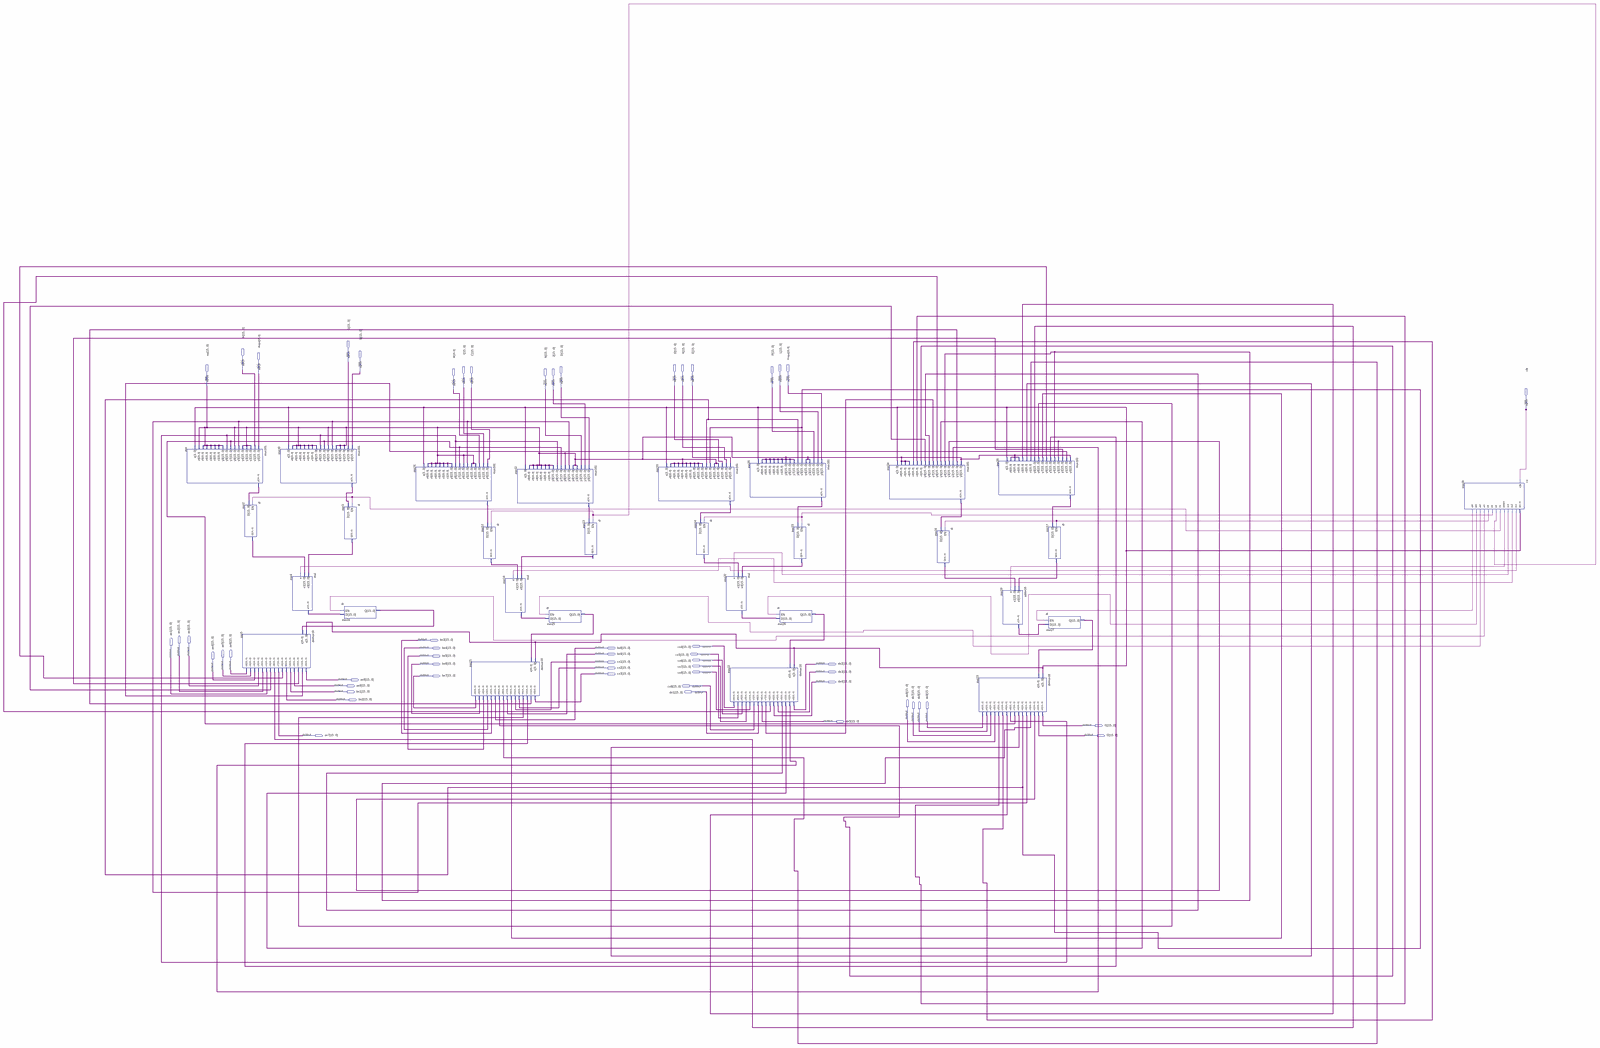
[diagram p0: schematic sheet, whole]
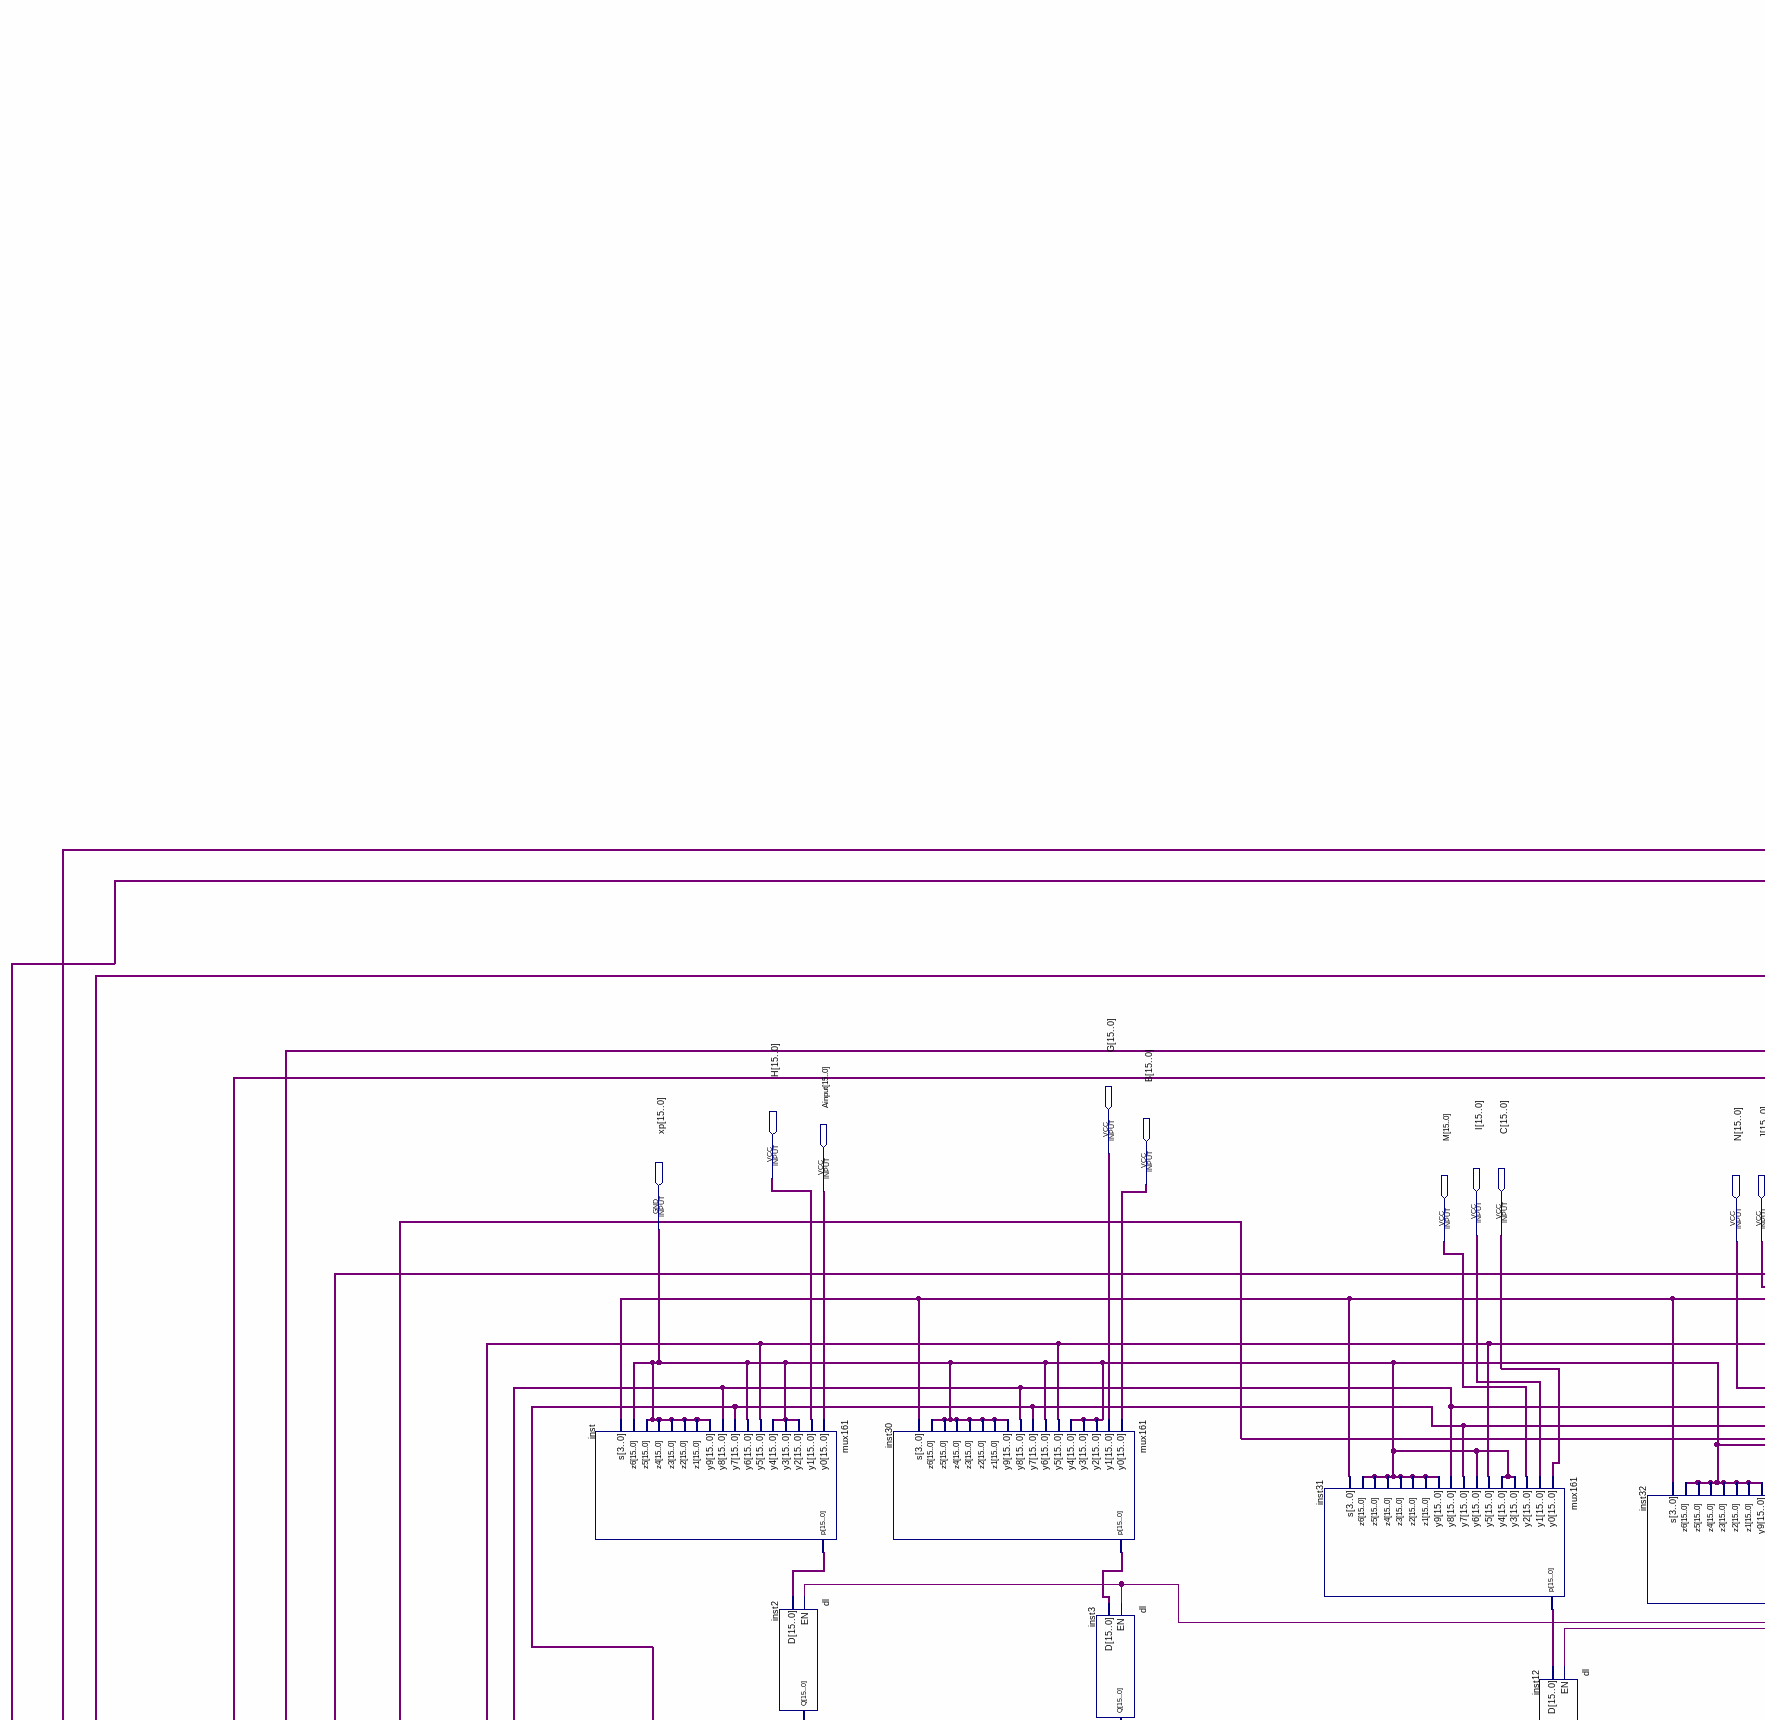
[diagram p1: schematic sheet, upper left part]
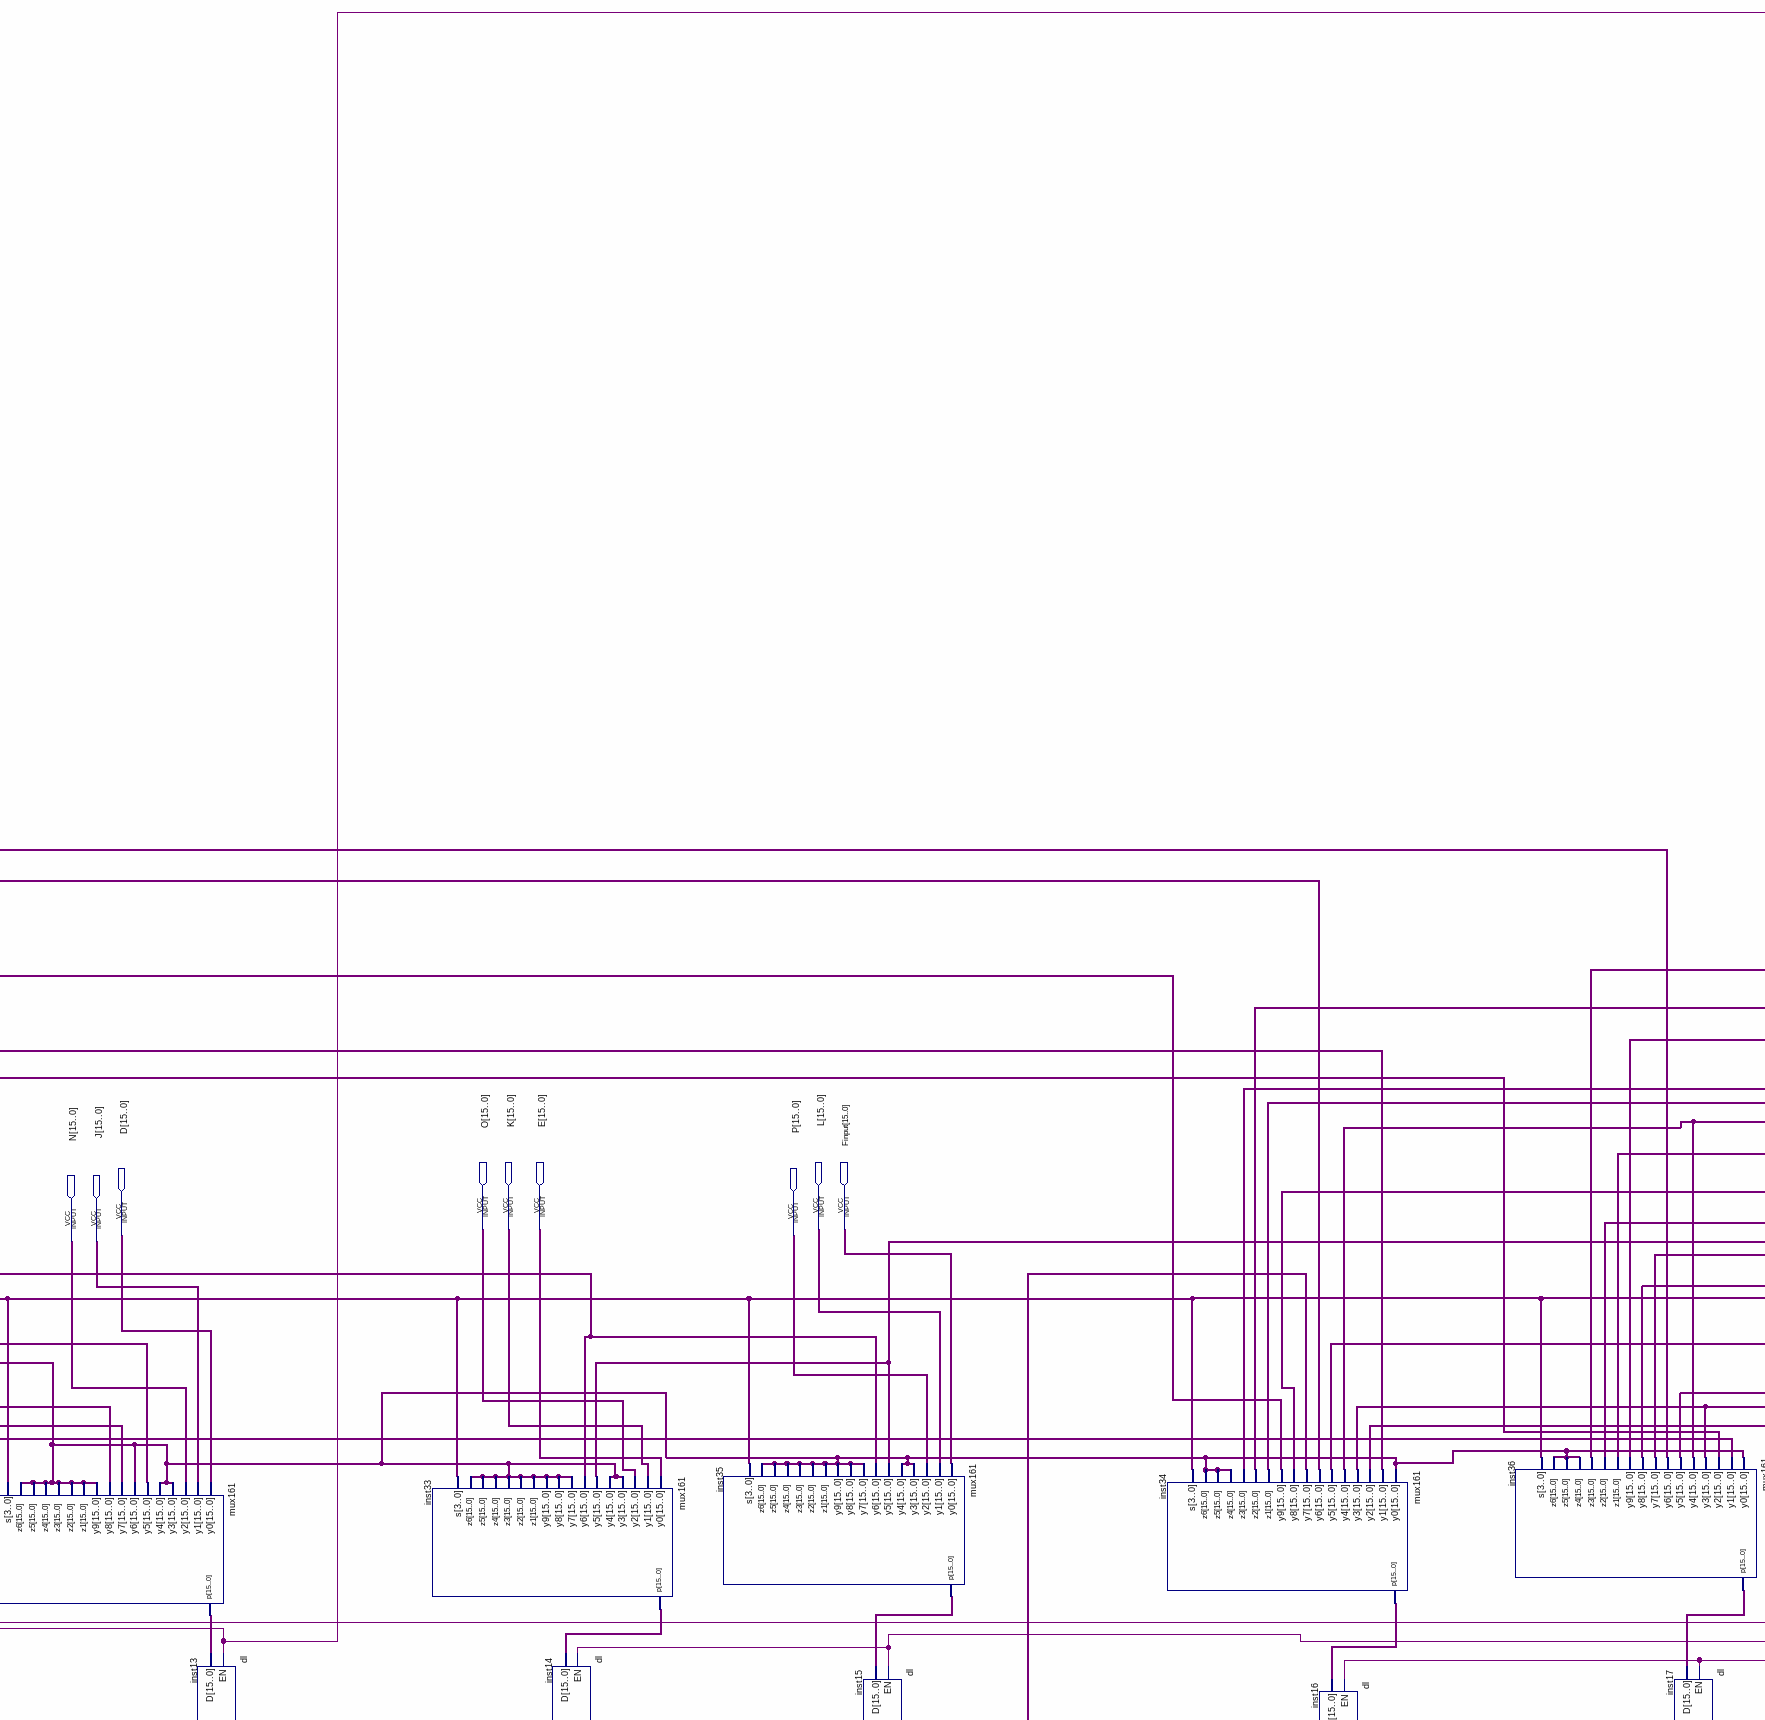
[diagram p2: schematic sheet, upper centre part]
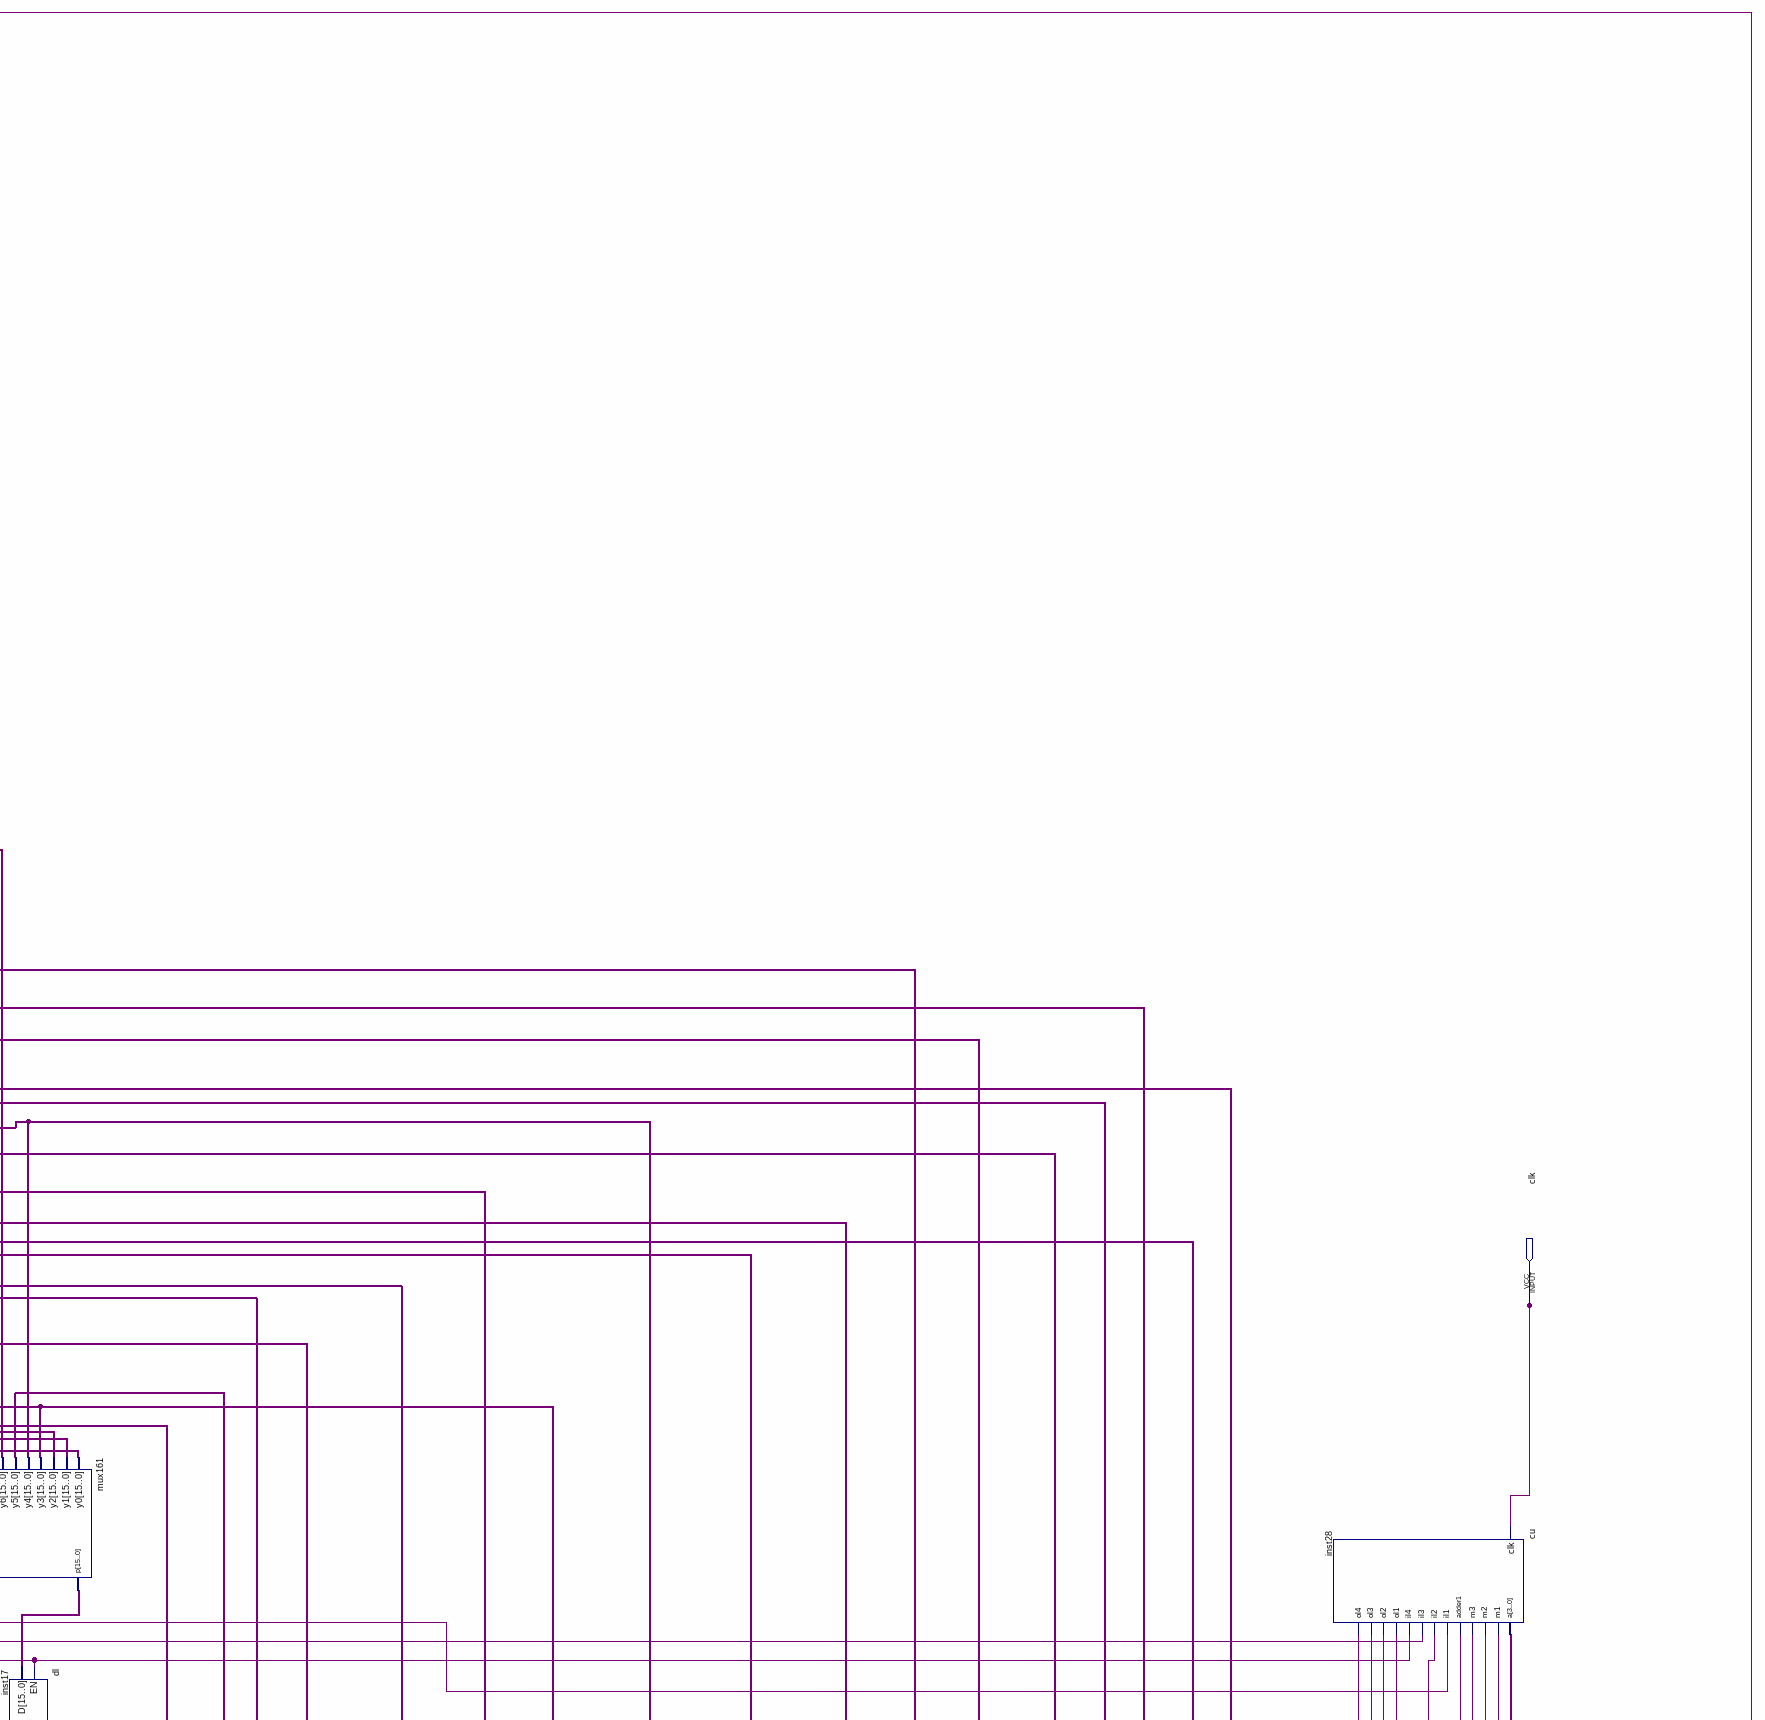
[diagram p3: schematic sheet, upper right part]
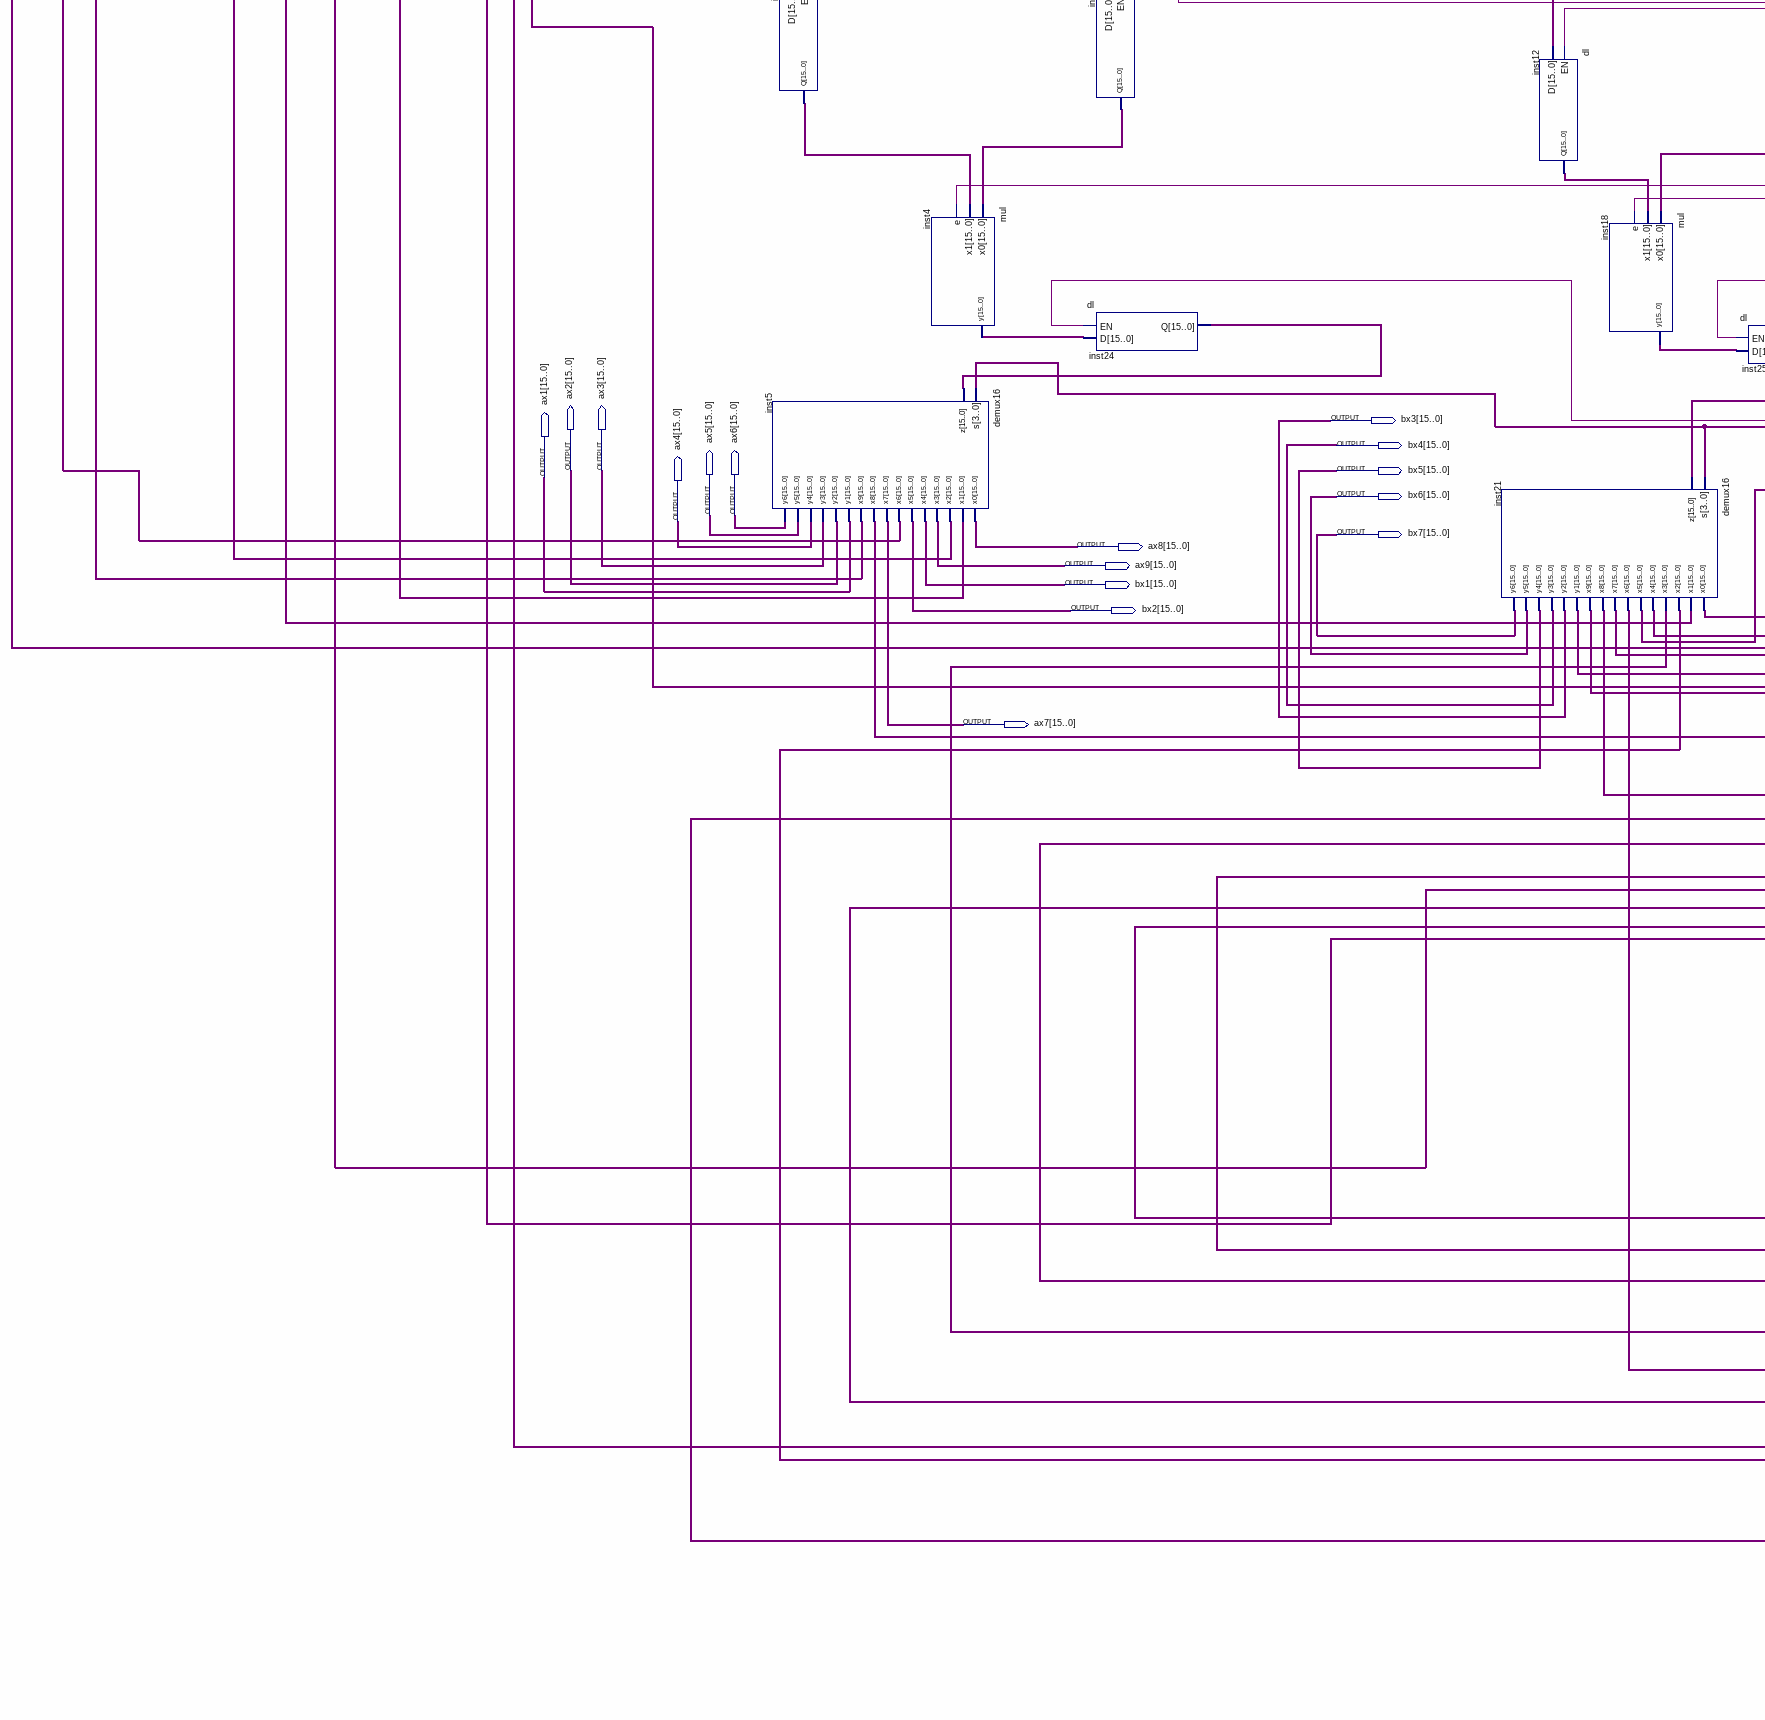
[diagram p4: schematic sheet, lower left part]
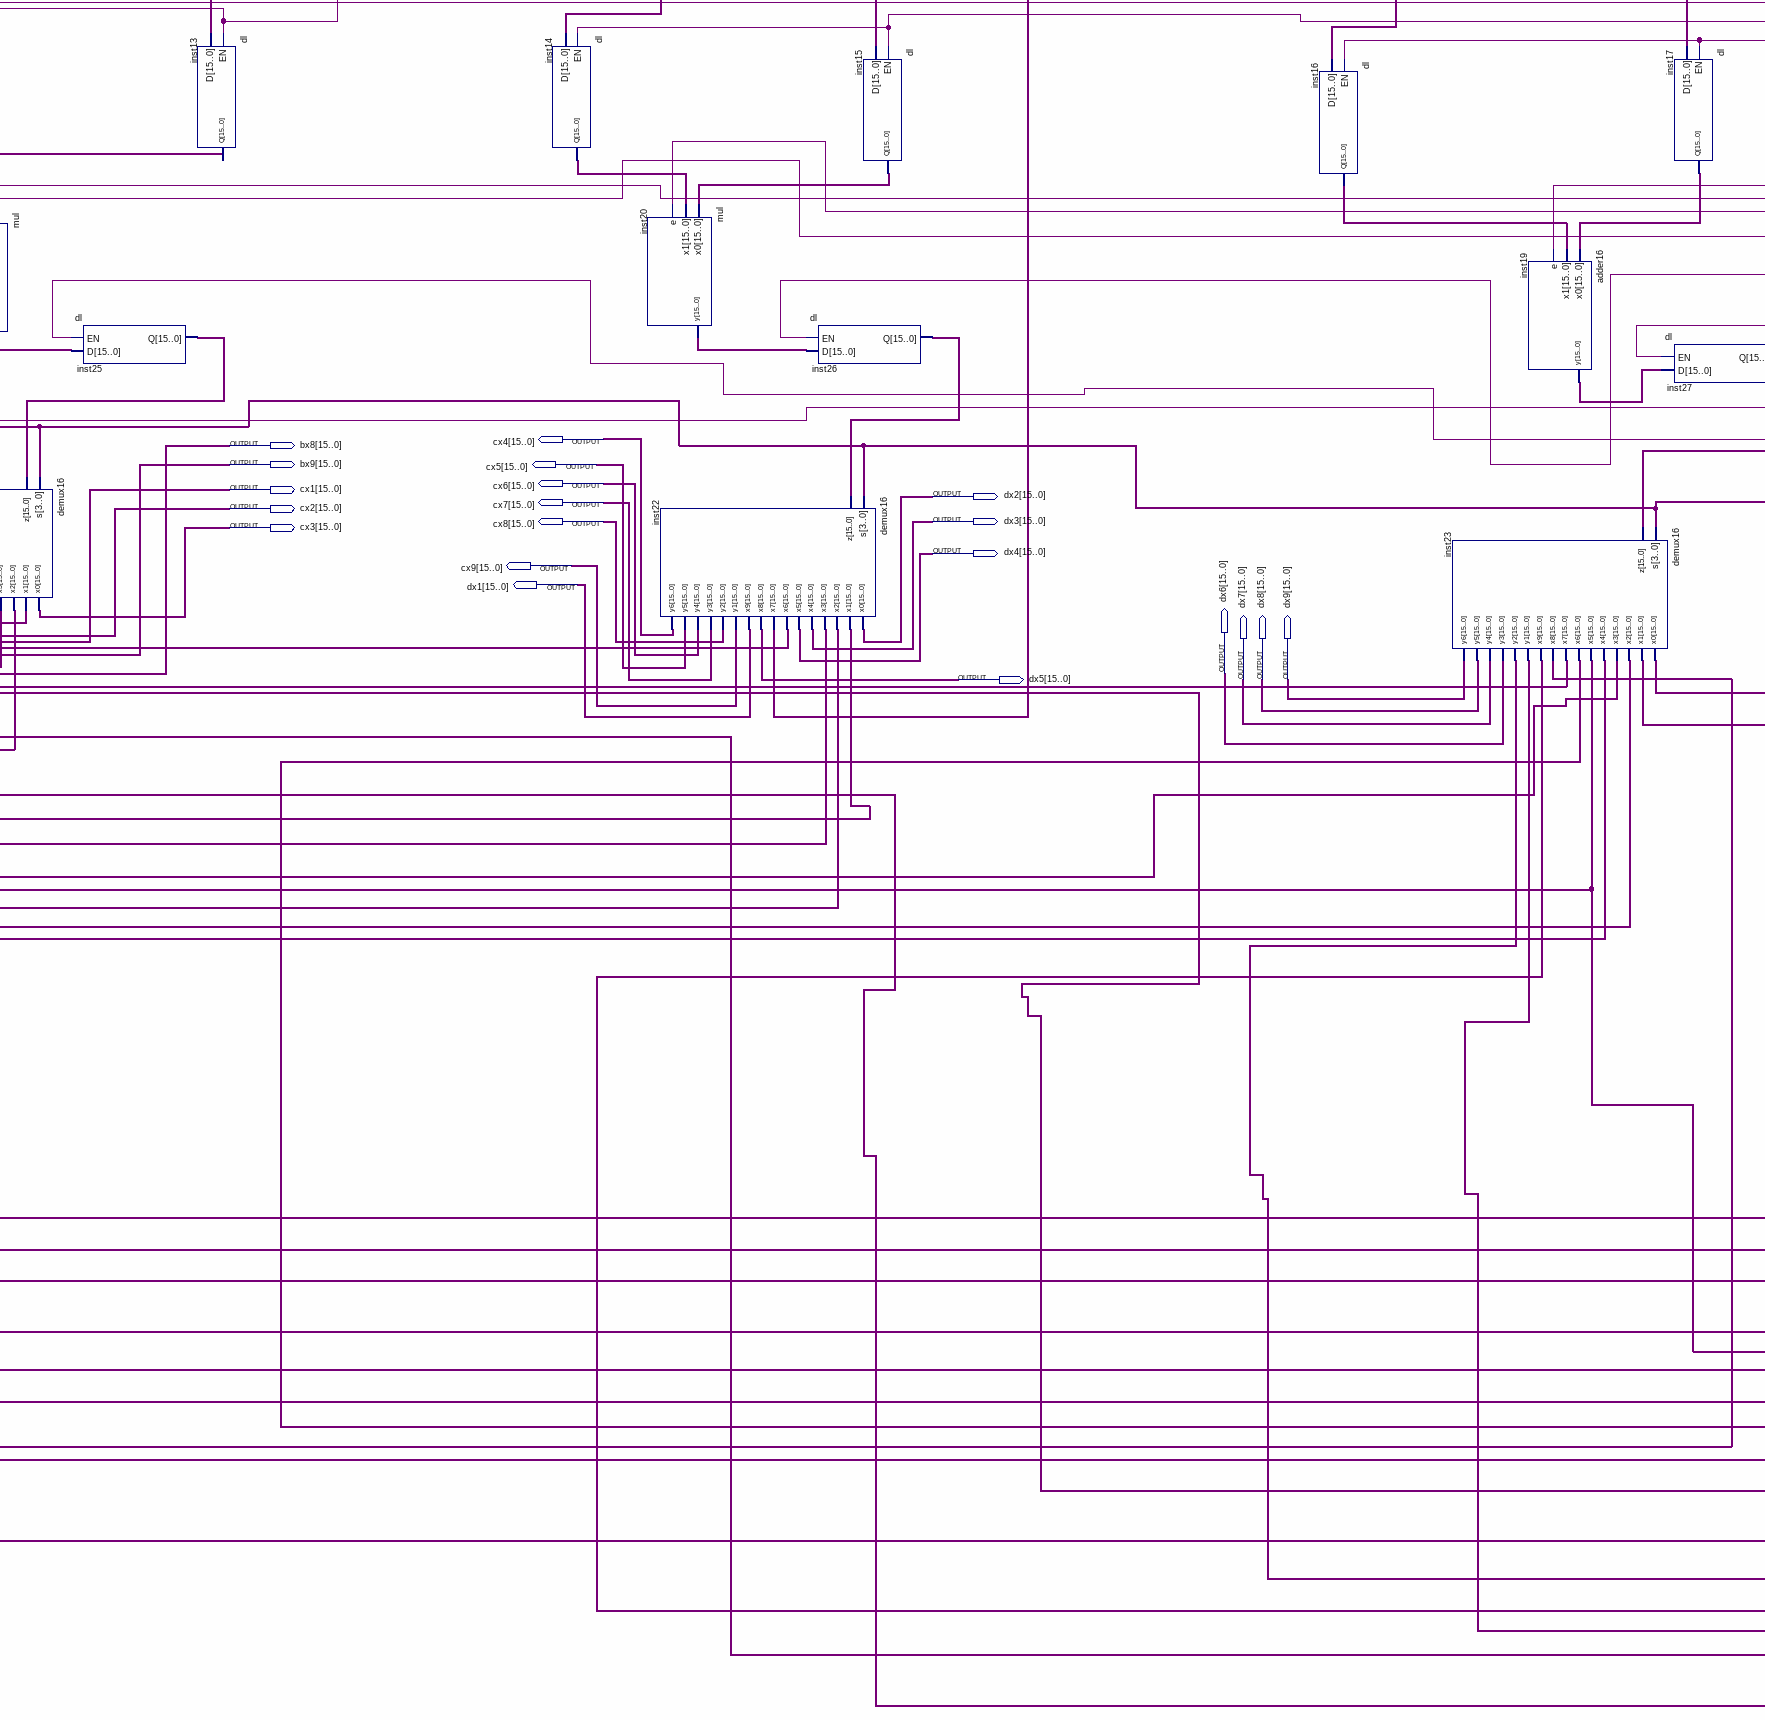
[diagram p5: schematic sheet, lower centre part]
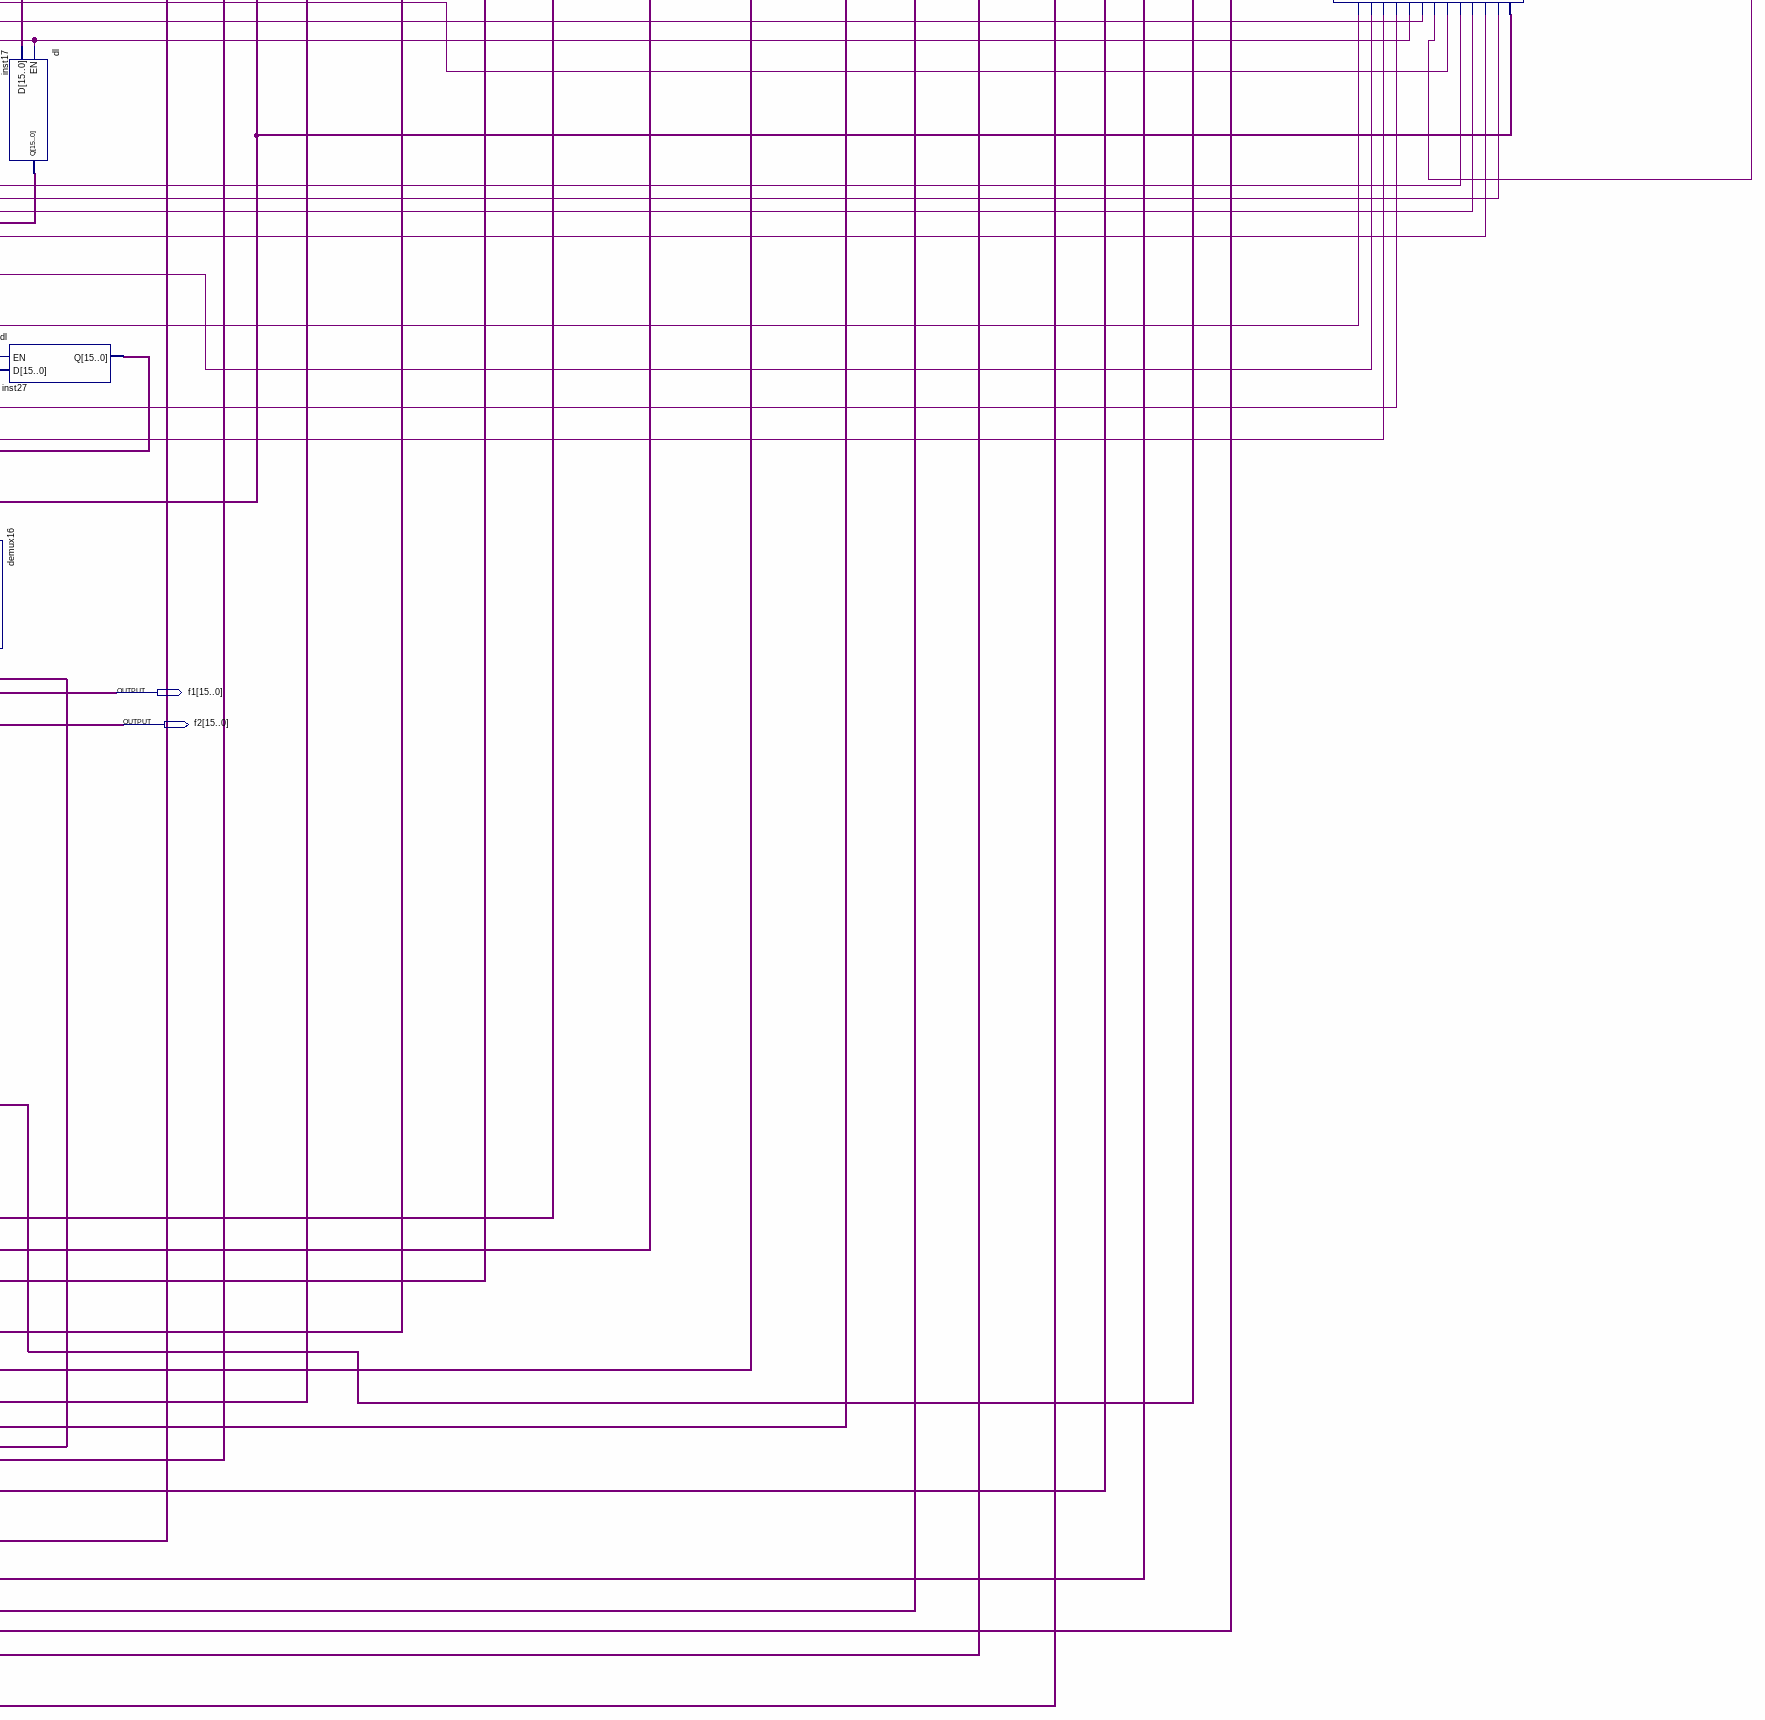
[diagram p6: schematic sheet, lower right part]
// Quartus schematic lab1.bdf as structural Verilog: 29 symbols, 56 pins
module lab1 (
  input  [15:0] G,
  input  [15:0] H,
  input  [15:0] B,
  input  [15:0] Ainput,
  input  [15:0] xp,
  input  [15:0] O,
  input  [15:0] K,
  input  [15:0] E,
  input  [15:0] L,
  input  [15:0] Finput,
  input  [15:0] I,
  input  [15:0] C,
  input  [15:0] D,
  input  [15:0] P,
  input  [15:0] M,
  input  [15:0] N,
  input  [15:0] J,
  input  clk,
  output [15:0] bx3,
  output [15:0] cx4,
  output [15:0] bx4,
  output [15:0] bx8,
  output [15:0] bx9,
  output [15:0] cx5,
  output [15:0] ax2,
  output [15:0] ax3,
  output [15:0] bx5,
  output [15:0] ax1,
  output [15:0] cx6,
  output [15:0] cx1,
  output [15:0] bx6,
  output [15:0] dx2,
  output [15:0] cx7,
  output [15:0] cx2,
  output [15:0] ax5,
  output [15:0] ax6,
  output [15:0] ax4,
  output [15:0] cx8,
  output [15:0] dx3,
  output [15:0] cx3,
  output [15:0] bx7,
  output [15:0] ax8,
  output [15:0] dx4,
  output [15:0] ax9,
  output [15:0] cx9,
  output [15:0] bx1,
  output [15:0] dx1,
  output [15:0] bx2,
  output [15:0] dx6,
  output [15:0] dx5,
  output [15:0] dx7,
  output [15:0] dx8,
  output [15:0] dx9,
  output [15:0] f1,
  output [15:0] ax7,
  output [15:0] f2
);

  wire inst28_adder1, inst28_il1, inst28_il2, inst28_il3, inst28_il4, inst28_m1, inst28_m2, inst28_m3,
       inst28_ol1, inst28_ol2, inst28_ol3, inst28_ol4;
  wire [3:0] inst28_a;
  wire [15:0] inst2_q, inst3_q, inst4_y, inst5_x1, inst5_x2, inst5_x6, inst5_x8, inst5_x9, inst12_q,
       inst13_q, inst14_q, inst15_q, inst16_q, inst17_q, inst18_y, inst19_y, inst20_y, inst21_x1, inst21_x2,
       inst21_x3, inst21_x6, inst21_x8, inst21_x9, inst22_x1, inst22_x2, inst22_x3, inst22_x6, inst22_x7,
       inst23_x2, inst23_x3, inst23_x4, inst23_x5, inst23_x6, inst23_x7, inst23_x8, inst23_x9, inst23_y1,
       inst23_y2, inst24_q, inst25_q, inst26_q, inst27_q, inst30_p, inst31_p, inst32_p, inst33_p, inst34_p,
       inst35_p, inst36_p, inst_p;

  mux161 inst (
    .y0(Ainput), .y1(H), .y2(xp), .y3(xp), .y4(xp), .y5(inst23_x4), .y6(xp), .y7(inst23_x7), .y8(inst23_x8),
    .y9(xp), .z1(xp), .z2(xp), .z3(xp), .z4(xp), .z5(xp), .z6(xp), .s(inst28_a), .p(inst_p));
  dl inst2 (.EN(inst28_il1), .D(inst_p), .Q(inst2_q));
  demux16 inst5 (
    .s(inst28_a), .z(inst24_q), .x0(ax8), .x1(inst5_x1), .x2(inst5_x2), .x3(ax9), .x4(bx1), .x5(bx2),
    .x6(inst5_x6), .x7(ax7), .x8(inst5_x8), .x9(inst5_x9), .y1(ax1), .y2(ax2), .y3(ax3), .y4(ax4), .y5(ax5),
    .y6(ax6));
  mux161 inst30 (
    .y0(B), .y1(G), .y2(xp), .y3(xp), .y4(xp), .y5(inst23_x4), .y6(xp), .y7(inst23_x7), .y8(inst23_x8),
    .y9(xp), .z1(xp), .z2(xp), .z3(xp), .z4(xp), .z5(xp), .z6(xp), .s(inst28_a), .p(inst30_p));
  mul inst4 (.x0(inst3_q), .x1(inst2_q), .e(inst28_m1), .y(inst4_y));
  dl inst3 (.EN(inst28_il1), .D(inst30_p), .Q(inst3_q));
  dl inst24 (.EN(inst28_ol1), .D(inst4_y), .Q(inst24_q));
  mux161 inst31 (
    .y0(C), .y1(I), .y2(M), .y3(xp), .y4(xp), .y5(inst23_x4), .y6(xp), .y7(inst23_x7), .y8(inst23_x8),
    .y9(xp), .z1(xp), .z2(xp), .z3(xp), .z4(xp), .z5(xp), .z6(xp), .s(inst28_a), .p(inst31_p));
  demux16 inst21 (
    .s(inst28_a), .z(inst25_q), .x0(cx3), .x1(inst21_x1), .x2(inst21_x2), .x3(inst21_x3), .x4(cx2), .x5(cx1),
    .x6(inst21_x6), .x7(bx9), .x8(inst21_x8), .x9(inst21_x9), .y1(bx8), .y2(bx3), .y3(bx4), .y4(bx5),
    .y5(bx6), .y6(bx7));
  dl inst12 (.EN(inst28_il2), .D(inst31_p), .Q(inst12_q));
  mux161 inst32 (
    .y0(D), .y1(J), .y2(N), .y3(xp), .y4(xp), .y5(inst23_x4), .y6(xp), .y7(inst23_x7), .y8(inst23_x8),
    .y9(xp), .z1(xp), .z2(xp), .z3(xp), .z4(xp), .z5(xp), .z6(xp), .s(inst28_a), .p(inst32_p));
  mul inst18 (.x0(inst13_q), .x1(inst12_q), .e(inst28_m2), .y(inst18_y));
  dl inst25 (.EN(inst28_ol2), .D(inst18_y), .Q(inst25_q));
  dl inst13 (.EN(inst28_il2), .D(inst32_p), .Q(inst13_q));
  mux161 inst33 (
    .y0(E), .y1(K), .y2(O), .y3(xp), .y4(xp), .y5(inst23_x5), .y6(inst23_x5), .y7(xp), .y8(xp), .y9(xp),
    .z1(xp), .z2(xp), .z3(xp), .z4(xp), .z5(xp), .z6(xp), .s(inst28_a), .p(inst33_p));
  dl inst14 (.EN(inst28_il3), .D(inst33_p), .Q(inst14_q));
  mul inst20 (.x0(inst15_q), .x1(inst14_q), .e(inst28_m3), .y(inst20_y));
  demux16 inst22 (
    .s(inst28_a), .z(inst26_q), .x0(dx2), .x1(inst22_x1), .x2(inst22_x2), .x3(inst22_x3), .x4(dx3), .x5(dx4),
    .x6(inst22_x6), .x7(inst22_x7), .x8(dx5), .x9(dx1), .y1(cx9), .y2(cx8), .y3(cx7), .y4(cx6), .y5(cx5),
    .y6(cx4));
  mux161 inst35 (
    .y0(Finput), .y1(L), .y2(P), .y3(xp), .y4(xp), .y5(inst23_x5), .y6(inst23_x5), .y7(xp), .y8(xp), .y9(xp),
    .z1(xp), .z2(xp), .z3(xp), .z4(xp), .z5(xp), .z6(xp), .s(inst28_a), .p(inst35_p));
  dl inst26 (.EN(inst28_ol3), .D(inst20_y), .Q(inst26_q));
  dl inst15 (.EN(inst28_il3), .D(inst35_p), .Q(inst15_q));
  mux161 inst34 (
    .y0(xp), .y1(inst21_x1), .y2(inst22_x1), .y3(inst23_x2), .y4(inst23_x3), .y5(inst22_x2), .y6(inst22_x6),
    .y7(inst22_x7), .y8(inst22_x3), .y9(inst5_x9), .z1(inst21_x9), .z2(inst23_y2), .z3(inst23_y1), .z4(xp),
    .z5(xp), .z6(xp), .s(inst28_a), .p(inst34_p));
  dl inst16 (.EN(inst28_il4), .D(inst34_p), .Q(inst16_q));
  demux16 inst23 (
    .s(inst28_a), .z(inst27_q), .x0(f1), .x1(f2), .x2(inst23_x2), .x3(inst23_x3), .x4(inst23_x4),
    .x5(inst23_x5), .x6(inst23_x6), .x7(inst23_x7), .x8(inst23_x8), .x9(inst23_x9), .y1(inst23_y1),
    .y2(inst23_y2), .y3(dx6), .y4(dx7), .y5(dx8), .y6(dx9));
  mux161 inst36 (
    .y0(xp), .y1(inst5_x1), .y2(inst5_x2), .y3(inst23_x2), .y4(inst23_x3), .y5(inst21_x2), .y6(inst5_x6),
    .y7(inst21_x6), .y8(inst21_x3), .y9(inst5_x8), .z1(inst21_x8), .z2(inst23_x6), .z3(inst23_x9), .z4(xp),
    .z5(xp), .z6(xp), .s(inst28_a), .p(inst36_p));
  adder16 inst19 (.x0(inst17_q), .x1(inst16_q), .e(inst28_adder1), .y(inst19_y));
  dl inst17 (.EN(inst28_il4), .D(inst36_p), .Q(inst17_q));
  dl inst27 (.EN(inst28_ol4), .D(inst19_y), .Q(inst27_q));
  cu inst28 (
    .clk(clk), .a(inst28_a), .m1(inst28_m1), .m2(inst28_m2), .m3(inst28_m3), .adder1(inst28_adder1),
    .il1(inst28_il1), .il2(inst28_il2), .il3(inst28_il3), .il4(inst28_il4), .ol1(inst28_ol1),
    .ol2(inst28_ol2), .ol3(inst28_ol3), .ol4(inst28_ol4));
endmodule
